# Altium schematic sheet Status_LEDS.SchDoc
size A4
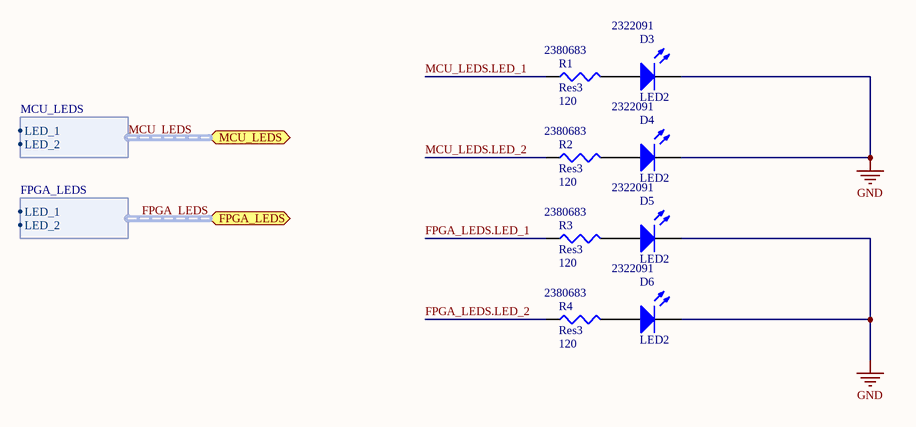
[diagram p0: Status_LEDS.SchDoc]

## Parts
D3  LED2  Supplier Part Number 1: 2322091  [C1206]
D4  LED2  Supplier Part Number 1: 2322091  [C1206]
D5  LED2  Supplier Part Number 1: 2322091  [C1206]
D6  LED2  Supplier Part Number 1: 2322091  [C1206]
R1  Res3  value 120  Supplier Part Number 1: 2380683  [14-1210]
R2  Res3  value 120  Supplier Part Number 1: 2380683  [14-1210]
R3  Res3  value 120  Supplier Part Number 1: 2380683  [14-1210]
R4  Res3  value 120  Supplier Part Number 1: 2380683  [14-1210]

## Ports
FPGA_LEDS (harness FPGA_LEDS), MCU_LEDS (harness MCU_LEDS)

## Harnesses
MCU_LEDS: LED_1, LED_2
FPGA_LEDS: LED_1, LED_2

## Nets
GND: D3.2(K) D4.2(K) D5.2(K) D6.2(K)
FPGA_LEDS.LED_1: R3.1
FPGA_LEDS.LED_2: R4.1
MCU_LEDS.LED_1: R1.1
MCU_LEDS.LED_2: R2.1
NetD3_1: D3.1(A) R1.2
NetD4_1: D4.1(A) R2.2
NetD5_1: D5.1(A) R3.2
NetD6_1: D6.1(A) R4.2

## Buses and harness runs
harness FPGA_LEDS = port FPGA_LEDS
harness MCU_LEDS = port MCU_LEDS

## Library data of the parts
D3-D6 = LED2: Typical RED, GREEN, YELLOW, AMBER GaAs LED; Manufacturer: WURTH ELEKTRONIK; Manufacturer Part Number: 156120GS75300; Published: 8-Jun-2000; LatestRevisionDate: 17-Jul-2002; LatestRevisionNote: Re-released for DXP Platform.; PackageVersion: Feb-2002; PackageReference: 3.2X1.6X1.1; Publisher: Altium Limited; PackageDescription: SM LED; 2 Flat Leads; Supplier 1: Farnell; RoHS: YES; Stock 1: 15358; Pricing 1: 1=5,3, 50=4,9, 100=4,6, 500=3,65, 2000=3,3, 5000=2,95, 5000=2,65, 30000=2,4 (EUR); ComponentLink1URL: http://katalog.we-online.de/led/datasheet/156120GS75300.pdf; ComponentLink1Description: http://katalog.we-online.de/led/datasheet/156120GS75300.pdf
R1-R4 = Res3: Resistor; Manufacturer: PANASONIC; Manufacturer Part Number: ERJU14F1200U; Product Range: PANASONIC - ERJ Series; Power Rating: 500; Resistance Tolerance: ± 1%; Resistor Case Style: 1210 [3225 Metric]; Resistor Element Material: Thick Film; Temperature Coefficient: ± 100; Voltage Rating: 200; SVHC: No SVHC (16-Dec-2013; Published: 8-Jun-2000; LatestRevisionDate: 29-May-2009; LatestRevisionNote: IPC-7351 Footprint Added.; PackageReference: J1-0603; Publisher: Altium Limited; PackageDescription: Chip Resistor; Supplier 1: Farnell; RoHS: YES; Stock 1: 2870; Pricing 1: 10=1,05, 100=0,951, 500=0,734, 1000=0,589, 5000=0,434 (EUR); Resistance: 120; Packaging: Cut Tape; MSL: -; ComponentLink1URL: http://www.farnell.com/datasheets/1783557.pdf; ComponentLink1Description: http://www.farnell.com/datasheets/1783557.pdf